# EAGLE design nanoPhant (EAGLE 9.2.2)
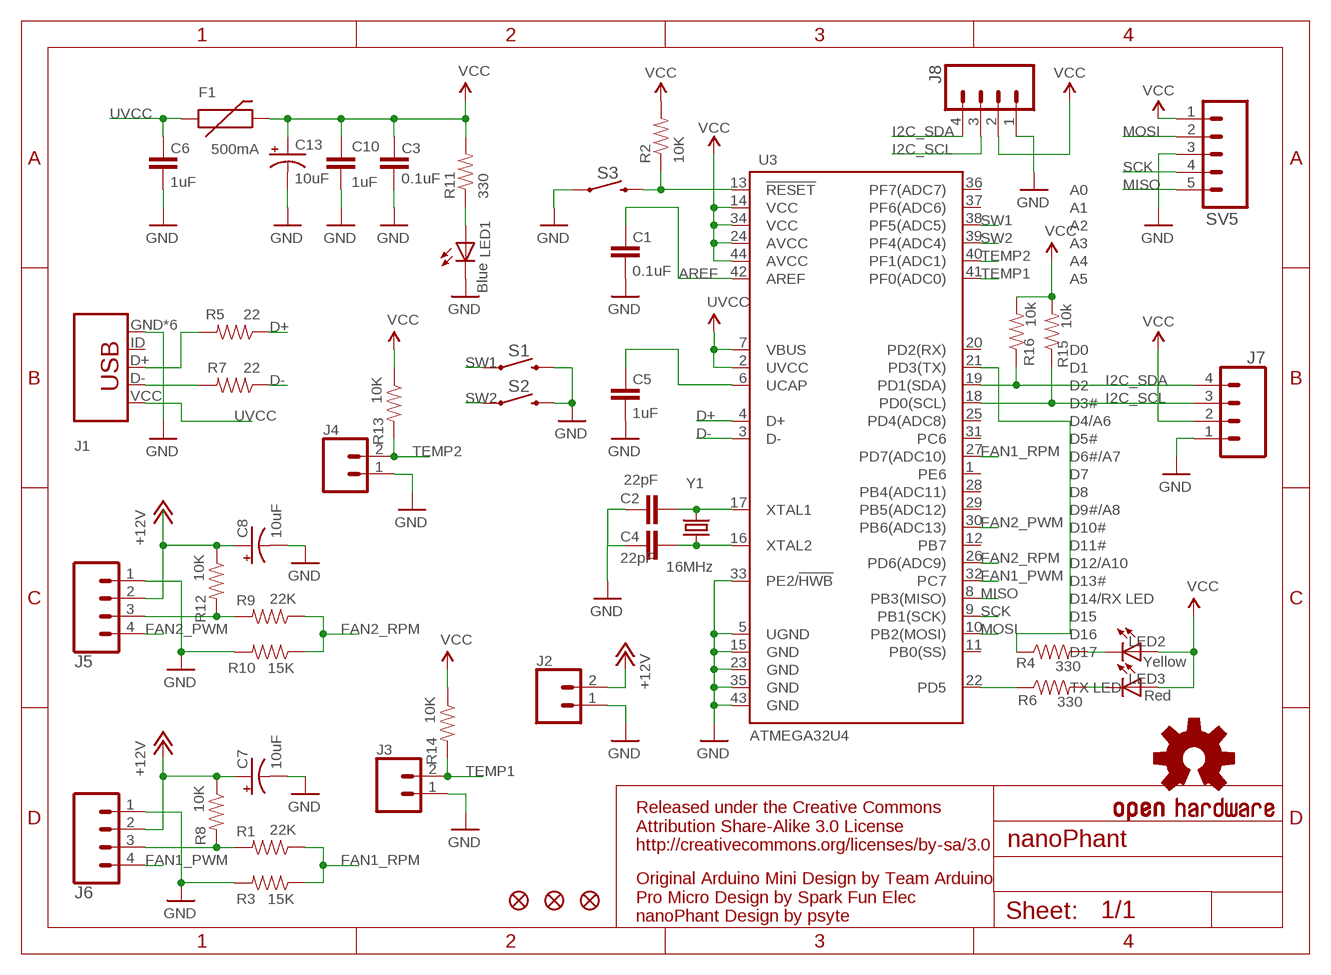
[diagram p0: schematic, sheet 1]

## Parts
C1  0.1uF  C-EUC0603  [C0603]
C2  22pF  C-EUC0603  [C0603]
C3  0.1uF  C-EUC0603  [C0603]
C4  22pF  C-EUC0603  [C0603]
C5  1uF  C-EUC0603  [C0603]
C6  1uF  C-EUC0603  [C0603]
C7  10uF  CAP_POL1206  [EIA3216]
C8  10uF  CAP_POL1206  [EIA3216]
C10  1uF  C-EUC0603  [C0603]
C13  10uF  CAP_POL1206  [EIA3216]
F1  500mA  PTCSMD  [PTC-1206]
FD1  FIDUCIAL1X2  [FIDUCIAL-1X2]
FD2  FIDUCIAL1X2  [FIDUCIAL-1X2]
FD3  FIDUCIAL1X2  [FIDUCIAL-1X2]
J1  AMP FCI 10103594-0001LF  MICRO-USB-B  [MICRO_USB_4_LEGS]
J2  CONN_02  [1X02]
J3  CONN_02  [1X02]
J4  CONN_02  [1X02]
J5  CONN_04  [1X04]
J6  CONN_04  [1X04]
J7  CONN_04  [1X04]
J8  CONN_04  [1X04]
LED1  Blue  LED0603  [LED-0603]
LED2  Yellow  LED0603  [LED-0603]
LED3  Red  LED0603  [LED-0603]
R1  22K  RESISTOR0603-RES  [0603-RES]
R2  10K  RESISTOR0603-RES  [0603-RES]
R3  15K  RESISTOR0603-RES  [0603-RES]
R4  330  RESISTOR0603-RES  [0603-RES]
R5  22  RESISTOR0603-RES  [0603-RES]
R6  330  RESISTOR0603-RES  [0603-RES]
R7  22  RESISTOR0603-RES  [0603-RES]
R8  10K  RESISTOR0603-RES  [0603-RES]
R9  22K  RESISTOR0603-RES  [0603-RES]
R10  15K  RESISTOR0603-RES  [0603-RES]
R11  330  RESISTOR0603-RES  [0603-RES]
R12  10K  RESISTOR0603-RES  [0603-RES]
R13  10K  RESISTOR0603-RES  [0603-RES]
R14  10K  RESISTOR0603-RES  [0603-RES]
R15  10k  RESISTOR0603-RES  [0603-RES]
R16  10k  RESISTOR0603-RES  [0603-RES]
S1  MOMENTARY-SWITCH-SPST-SMD-6.0X3.5MM  [TACTILE_SWITCH_SMD_6.0X3.5MM]
S2  MOMENTARY-SWITCH-SPST-SMD-6.0X3.5MM  [TACTILE_SWITCH_SMD_6.0X3.5MM]
S3  MOMENTARY-SWITCH-SPST-SMD-6.0X3.5MM  [TACTILE_SWITCH_SMD_6.0X3.5MM]
SV5  CONN_05  [1X05]
U3  ATMEGA32U4  ATMEGA32U4OUTFAKES  [QFN-44-NOPAD_1:1-OUTFAKES]
U$3  OSHW-LOGOS  [OSHW-LOGO-S]
Y1  16MHz  CRYSTAL5X3  [CRYSTAL-SMD-5X3]

## Nets
+12V: C7.A(+) C8.A(+) J2.2 J5.2 J6.2 R8.1 R12.1
AREF: C1.2 U3.42(AREF)
D+: R5.1 U3.4(D+)
D-: R7.1 U3.3(D-)
FAN1_PWM: J6.4 U3.32(PC7)
FAN1_RPM: R1.1 R3.1 U3.27(PD7(ADC10))
FAN2_PWM: J5.4 U3.30(PB6(ADC13))
FAN2_RPM: R9.1 R10.1 U3.26(PD6(ADC9))
GND [vcc]: C1.1 C2.2 C3.1 C4.2 C5.1 C6.1 C7.C(-) C8.C(-) C10.2 C13.C(-) J1.GND J1.P$1(GND) J1.P$2(GND) J1.P$3(GND) J1.P$4(GND) J1.P$5(GND) J2.1 J3.1 J4.1 J5.1 J6.1 J7.1 J8.1 LED1.C R3.2 R10.2 S1.2 S2.2 S3.1 SV5.3 U3.5(UGND) U3.15(GND) U3.23(GND) U3.33(PE2/!HWB) U3.35(GND) U3.43(GND)
I2C_SCL: J7.3 J8.3 R15.1 U3.18(PD0(SCL))
I2C_SDA: J7.4 J8.4 R16.1 U3.19(PD1(SDA))
MISO: SV5.5 U3.8(PB3(MISO))
MOSI: SV5.2 U3.10(PB2(MOSI))
N$1: C4.1 U3.16(XTAL2) Y1.1
N$2: C2.1 U3.17(XTAL1) Y1.3
N$3: R4.1 U3.21(PD3(TX))
N$4: C5.2 U3.6(UCAP)
N$5: LED2.C R4.2
N$6: J1.D- R7.2
N$7: LED3.C R6.2
N$8: J1.D+ R5.2
N$9: J6.3 R1.2 R8.2
N$10: J5.3 R9.2 R12.2
N$38: LED1.A R11.1
RESET: R2.1 S3.2 U3.13(!RESET)
SCK: SV5.4 U3.9(PB1(SCK))
SW1: S1.1 U3.38(PF5(ADC5))
SW2: S2.1 U3.39(PF4(ADC4))
TEMP1: J3.2 R14.2 U3.41(PF0(ADC0))
TEMP2: J4.2 R13.2 U3.40(PF1(ADC1))
TXLED: R6.1 U3.22(PD5)
UVCC: C6.2 F1.1 J1.VCC(VBUS) U3.2(UVCC) U3.7(VBUS)
VCC: C3.2 C10.1 C13.A(+) F1.2 J7.2 J8.2 LED2.A LED3.A R2.2 R11.2 R13.1 R14.1 R15.2 R16.2 SV5.1 U3.14(VCC) U3.24(AVCC) U3.34(VCC) U3.44(AVCC)
Unconnected: J1.ID U3.1(PE6) U3.11(PB0(SS)) U3.12(PB7) U3.20(PD2(RX)) U3.25(PD4(ADC8)) U3.28(PB4(ADC11)) U3.29(PB5(ADC12)) U3.31(PC6) U3.36(PF7(ADC7)) U3.37(PF6(ADC6))

## Notes on the sheet
- Released under the Creative Commons
  Attribution Share-Alike 3.0 License
  http://creativecommons.org/licenses/by-sa/3.0
- Original Arduino Mini Design by Team Arduino
  Pro Micro Design by Spark Fun Elec
  nanoPhant Design by psyte

## Library data of the parts
C1-C6 C10 = rcl:C-EU: CAPACITOR, European symbol; SPICEPREFIX: C
C7 C8 C13 = SparkFun:CAP_POL: Capacitor Polarized These are standard SMD and PTH capacitors. Normally 10uF, 47uF, and 100uF in electrolytic and tantalum varieties. Always verify the external diameter of the through hole cap, it varies with capacity, voltage, and manufacturer. The EIA devices should be standard.
F1 = SparkFun:PTC: Resettable Fuse PTC Resettable Fuse. Spark Fun Electronics SKU : COM-08357
FD1-FD3 = SparkFun-Aesthetics:FIDUCIAL: Fiducial Alignment Points Point-of-reference for pick-and-place machines and other optical instruments.
J1 = pmc_lib:MICRO-USB-B
J2-J4 = SparkFun-Connectors:CONN_02: Multi connection point. Often used as Generic Header-pin footprint for 0.1 inch spaced/style header connections On any of the 0.1 inch spaced packages, you can populate with these: Break Away Headers - Straight <https://www.sparkfun.com/products/116> (PRT-00116) Break Away Male Headers - Right Angle <https://www.sparkfun.com/products/553> (PRT-00553) Female Headers <https://www.sparkfun.com/products/115> (PRT-00115) Break Away Headers - Machine Pin <https://www.sparkfun.com/products/117> (PRT-00117) Break Away Female Headers - Swiss Machine Pin <https://www.sparkfun.com/products/743> (PRT-00743) For SCREWTERMINALS and SPRING TERMINALS visit here: Screw Terimnals on SparkFun.com <https://www.sparkfun.com/search/results?term=Screw+Terminals> (5mm/3.5mm/2.54mm spacing) This device is also useful as a general connection point to wire up your design to another part of your project. Our various solder wires solder well into these plated through hole pads. Hook-Up Wire - Assortment (Stranded, 22 AWG) <https://www.sparkfun.com/products/11375> (PRT-11375) Hook-Up Wire - Assortment (Solid Core, 22 AWG) <https://www.sparkfun.com/products/11367> (PRT-11367) View the entire wire category on our website here <https://www.sparkfun.com/categories/141> Special notes: Molex polarized connector foot print use with: PRT-08233 with associated crimp pins and housings. 2.54_SCREWTERM for use with PRT-10571. 3.5mm Screw Terminal footprints for PRT-08084 5mm Screw Terminal footprints for use with PRT-08432
J5-J8 = SparkFun-Connectors:CONN_04: Multi connection point. Often used as Generic Header-pin footprint for 0.1 inch spaced/style header connections On any of the 0.1 inch spaced packages, you can populate with these: Break Away Headers - Straight <https://www.sparkfun.com/products/116> (PRT-00116) Break Away Male Headers - Right Angle <https://www.sparkfun.com/products/553> (PRT-00553) Female Headers <https://www.sparkfun.com/products/115> (PRT-00115) Break Away Headers - Machine Pin <https://www.sparkfun.com/products/117> (PRT-00117) Break Away Female Headers - Swiss Machine Pin <https://www.sparkfun.com/products/743> (PRT-00743) For SCREWTERMINALS and SPRING TERMINALS visit here: Screw Terimnals on SparkFun.com <https://www.sparkfun.com/search/results?term=Screw+Terminals> (5mm/3.5mm/2.54mm spacing) This device is also useful as a general connection point to wire up your design to another part of your project. Our various solder wires solder well into these plated through hole pads. Hook-Up Wire - Assortment (Stranded, 22 AWG) <https://www.sparkfun.com/products/11375> (PRT-11375) Hook-Up Wire - Assortment (Solid Core, 22 AWG) <https://www.sparkfun.com/products/11367> (PRT-11367) View the entire wire category on our website here <https://www.sparkfun.com/categories/141> Special notes: Molex polarized connector foot print use with SKU : PRT-08231 with associated crimp pins and housings. 1MM SMD Version SKU: PRT-10208; PROD_ID: CONN-09696
LED1-LED3 = SparkFun:LED: LEDs Standard schematic elements and footprints for 5mm, 3mm, 1206, and 0603 sized LEDs. 5mm - Spark Fun Electronics SKU : COM-00529 (and others)
R1-R16 = SparkFun:RESISTOR: Resistor Basic schematic elements and footprints for 0603, 1206, and PTH resistors.
S1-S3 = SparkFun-Switches:MOMENTARY-SWITCH-SPST: Momentary Switch (Pushbutton) - SPST Normally-open (NO) SPST momentary switches (buttons, pushbuttons). Variants PTH-12MM - 12mm square, through-hole Momentary Pushbutton Switch - 12mm Square <https://www.sparkfun.com/products/9190> (COM-09190) PTH-6.0MM, PTH-6.0MM-KIT - 6.0mm square, through-hole Mini Pushbutton Switch <https://www.sparkfun.com/products/97> (COM-00097) KIT package intended for soldering kit's - only one side of pads' copper is exposed. PTH-RIGHT-ANGLE-KIT - Right-angle, through-hole Right Angle Tactile Button <https://www.sparkfun.com/products/10791> - Used on SparkFun BigTime Watch Kit <https://www.sparkfun.com/products/11734> SMD-12MM - 12mm square, surface-mount Tactile Button - SMD (12mm) <https://www.sparkfun.com/products/12993> (COM-12993) Used on SparkFun PicoBoard <https://www.sparkfun.com/products/11888> SMD-4.5MM - 4.5mm Square Trackball Switch Used on SparkFun Blackberry Trackballer Breakout <https://www.sparkfun.com/products/13169> SMD-4.6MMX2.8MM - 4.60mm x 2.80mm, surface mount Used on SparkFun SAMD21 Mini Breakout <https://www.sparkfun.com/products/13664> SMD-5.2MM, SMD-5.2-REDUNDANT - 5.2mm square, surface-mount Mini Pushbutton Switch - SMD <https://www.sparkfun.com/products/8720> (COM-08720) Used on Arduino Pro Mini <https://www.sparkfun.com/products/11114> REDUNDANT package connects both switch circuits together SMD-6.0X3.5MM - 6.0 x 3.5mm, surface mount Momentary Reset Switch SMD <https://www.sparkfun.com/products/8229> (COM-08229) SMD-6.2MM-TALL - 6.2mm square, surface mount Tactile Button - SMD (6mm) <https://www.sparkfun.com/products/12992> Used on SparkFun Digital Sandbox <https://www.sparkfun.com/products/12651> SMD-RIGHT-ANGLE - Right-angle, surface mount Used on SparkFun Block for Intel® Edison - Arduino <https://www.sparkfun.com/products/13036>; PROD_ID: SWCH-00815; SF_SKU: COM-08229
SV5 = SparkFun-Connectors:CONN_05: Multi connection point. Often used as Generic Header-pin footprint for 0.1 inch spaced/style header connections On any of the 0.1 inch spaced packages, you can populate with these: Break Away Headers - Straight <https://www.sparkfun.com/products/116> (PRT-00116) Break Away Male Headers - Right Angle <https://www.sparkfun.com/products/553> (PRT-00553) Female Headers <https://www.sparkfun.com/products/115> (PRT-00115) Break Away Headers - Machine Pin <https://www.sparkfun.com/products/117> (PRT-00117) Break Away Female Headers - Swiss Machine Pin <https://www.sparkfun.com/products/743> (PRT-00743) For SCREWTERMINALS and SPRING TERMINALS visit here: Screw Terimnals on SparkFun.com <https://www.sparkfun.com/search/results?term=Screw+Terminals> (5mm/3.5mm/2.54mm spacing) This device is also useful as a general connection point to wire up your design to another part of your project. Our various solder wires solder well into these plated through hole pads. Hook-Up Wire - Assortment (Stranded, 22 AWG) <https://www.sparkfun.com/products/11375> (PRT-11375) Hook-Up Wire - Assortment (Solid Core, 22 AWG) <https://www.sparkfun.com/products/11367> (PRT-11367) View the entire wire category on our website here <https://www.sparkfun.com/categories/141> Special notes: Molex polarized connector foot print use with SKU : PRT-08231 with associated crimp pins and housings. 1MM SMD Version SKU: PRT-10208
U3 = Testing:ATMEGA32U4: Atmel 44-pin 8-bit Microcontroller with 32KBytes of ISP Flash and USB Controller
U$3 = SparkFun:OSHW-LOGO: Open Source Hardware Logo This logo indicates the piece of hardware it is found on incorporates a OSHW license and/or adheres to the definition of open source hardware found here: http://freedomdefined.org/OSHW
Y1 = SparkFun:CRYSTAL: Crystals Various standard crystals. Proven footprints. Spark Fun Electronics SKU : COM-00534

## Net classes
0 default: width 0.203 mm

## Board
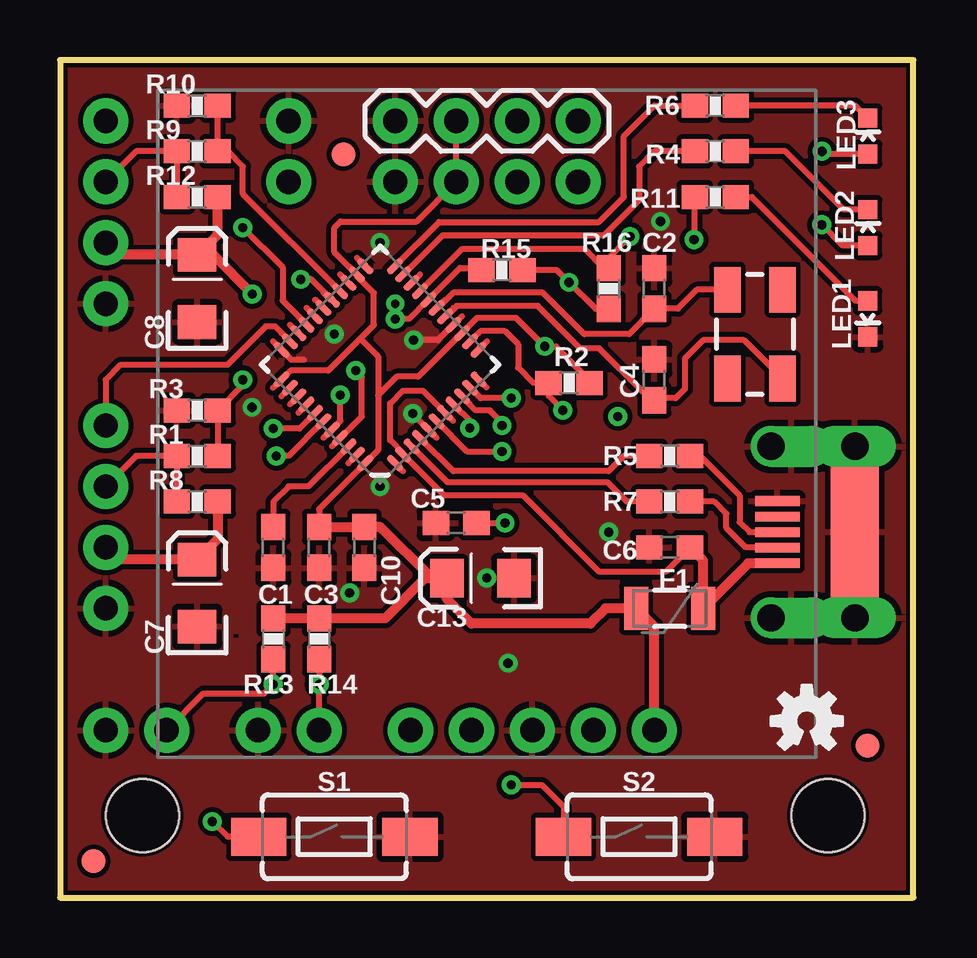
[diagram p1: board, top side]
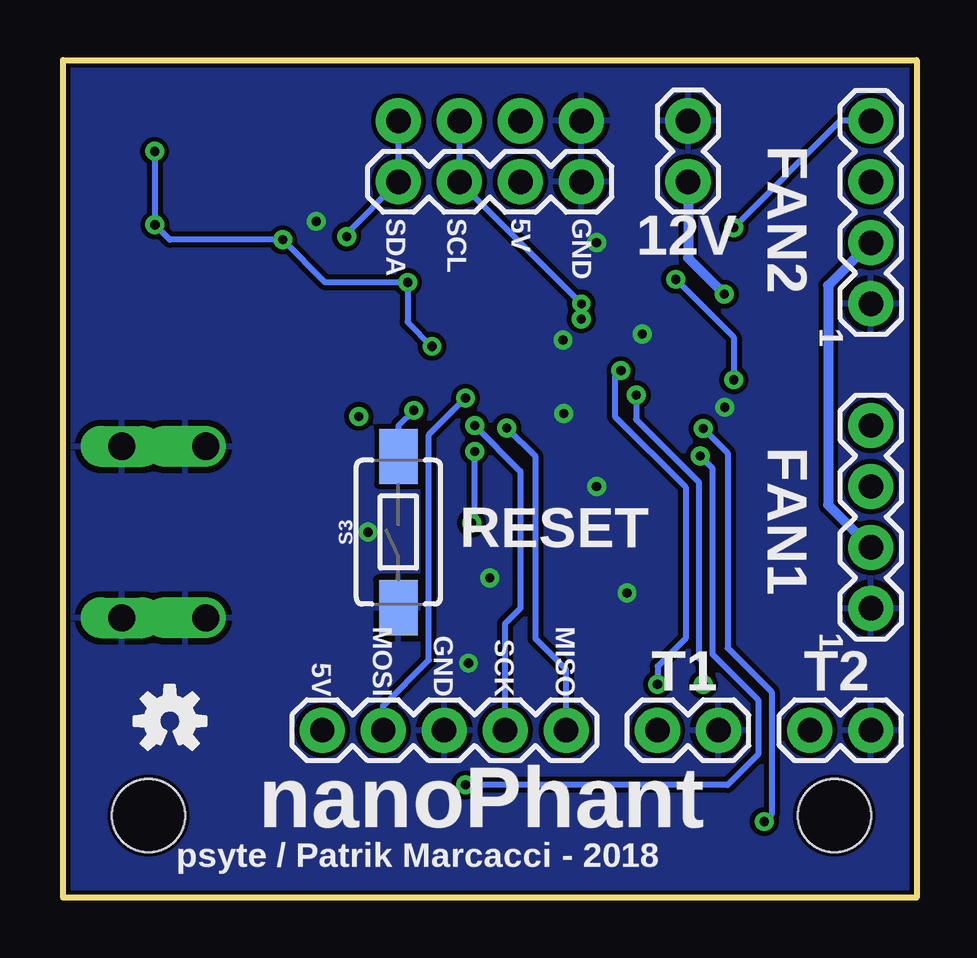
[diagram p2: board, bottom side, seen from below]

Size 35.56 x 34.92 mm. Coordinates in mm from the lower left corner, seen from the top.
Outline: 0,34.92 0,0 35.56,0 35.56,34.92 0,34.92
Copper layers (1*16): Top 0.035mm / dielectric 1.5mm / Bottom 0.035mm
Design rules "SparkFun *": minimum track width 8mil, minimum drill 15mil, track to track 8mil, track to pad 8mil, pad to pad 8mil, via to via 8mil, smd to smd 0mil, copper to edge 7mil, drill to drill 7mil, minimum pad ring 8mil, minimum via ring 8mil, stop-mask expansion 1mil, vias tented up to drill 16mil, thermal gap 10mil
Holes 3.05 mm at 3.43,3.43 32,3.43
tRestrict: area 7.2,10.9 to 7.4,11

### Footprints (pad centres in the part's own frame; a part is rotated, then mirrored left to right if it is on the bottom)
C0603 = smd 1.1 x 1: 1 -0.85,0; 2 0.85,0
EIA3216 = smd 1.4 x 1.6: A 1.4,0; C -1.4,0
PTC-1206 = smd 1 x 1.8: 1 -1.4,0; 2 1.4,0
FIDUCIAL-1X2 = smd 1 x 1: 1 0,0
MICRO_USB_4_LEGS = smd 1.85 x 0.4: D+ 3.125,0; D- 3.125,0.65; GND 3.125,-1.3; ID 3.125,-0.65; VCC 3.125,1.3 | drill 1.143 pad 1.524 long: P$1 -0.1,3.575; P$2 -0.1,-3.575 | drill 1.143 pad 1.524 offset: P$3 3.4,3.575; P$5 3.4,-3.575 | smd 2 x 6: P$4 -0.1,0
1X02 = drill 1.016 pad 1.88: 1 0,0; 2 2.54,0
1X04 = drill 1.016 pad 1.88: 1 0,0; 2 2.54,0; 3 5.08,0; 4 7.62,0
LED-0603 = smd 0.8 x 0.8: A 0,-0.75; C 0,0.75
0603-RES = smd 1.1 x 1: 1 -0.85,0; 2 0.85,0
TACTILE_SWITCH_SMD_6.0X3.5MM = smd 2.3 x 1.6: 1 -3.15,0; 2 3.15,0
1X05 = drill 1.016 pad 1.88: 1 0,0; 2 2.54,0; 3 5.08,0; 4 7.62,0; 5 10.16,0
QFN-44-NOPAD_1:1-OUTFAKES = smd 0.8 x 0.3: 1 -3.337,2.465; 2 -3.337,1.972; 3 -3.337,1.479; 4 -3.337,0.986; 5 -3.337,0.493; 6 -3.337,0; 7 -3.337,-0.493; 8 -3.337,-0.986; 9 -3.337,-1.479; 10 -3.337,-1.972; 11 -3.337,-2.465; 23 3.337,-2.465; 24 3.337,-1.972; 25 3.337,-1.479; 26 3.337,-0.986; 27 3.337,-0.493; 28 3.337,0; 29 3.337,0.493; 30 3.337,0.986; 31 3.337,1.479; 32 3.337,1.972; 33 3.337,2.465 | smd 0.3 x 0.8: 12 -2.465,-3.337; 13 -1.972,-3.337; 14 -1.479,-3.337; 15 -0.986,-3.337; 16 -0.493,-3.337; 17 0,-3.337; 18 0.493,-3.337; 19 0.986,-3.337; 20 1.479,-3.337; 21 1.972,-3.337; 22 2.465,-3.337; 34 2.465,3.337; 35 1.972,3.337; 36 1.479,3.337; 37 0.986,3.337; 38 0.493,3.337; 39 0,3.337; 40 -0.493,3.337; 41 -0.986,3.337; 42 -1.479,3.337; 43 -1.972,3.337; 44 -2.465,3.337
CRYSTAL-SMD-5X3 = smd 1.9 x 1.1: 1 -1.85,-1.15; 2 1.85,-1.15; 3 1.85,1.15; 4 -1.85,1.15

### Placement (x,y rotation side)
C1  8.89,14.61 90 top
C2  24.77,25.4 90 top
C3  10.79,14.61 90 top
C4  24.77,21.59 90 top
C5  16.51,15.62 0 top
C6  25.4,14.61 0 top
C7  5.71,12.7 90 top
C8  5.71,25.4 90 top
C10  12.69,14.61 270 top
C13  17.52,13.32 180 top
F1  25.4,12.06 180 top
FD1  33.66,6.35 0 top
FD2  11.81,30.99 0 top
FD3  1.4,1.52 0 top
J1  33.02,15.24 180 top
J2  9.53,32.38 270 bottom
J3  8.26,6.99 180 bottom
J4  1.91,6.99 180 bottom
J5  1.91,24.77 90 bottom
J6  1.91,12.06 90 bottom
J7  13.97,29.84 180 bottom
J8  13.97,32.38 0 top
LED1  33.66,24.13 180 top
LED2  33.66,27.94 0 top
LED3  33.66,31.75 0 top
R1  5.71,18.41 180 top
R2  21.21,21.46 0 top
R3  5.71,20.32 180 top
R4  27.3,31.11 0 top
R5  25.4,18.41 0 top
R6  27.3,33.02 0 top
R7  25.4,16.51 0 top
R8  5.71,16.51 180 top
R9  5.71,31.11 180 top
R10  5.71,33.02 180 top
R11  27.3,29.21 180 top
R12  5.71,29.21 180 top
R13  8.89,10.79 270 top
R14  10.79,10.79 270 top
R15  18.41,26.16 0 top
R16  22.86,25.4 270 top
S1  11.43,2.54 0 top
S2  24.13,2.54 0 top
S3  21.59,15.24 90 bottom
SV5  24.77,6.99 0 bottom
U3  13.34,22.23 135 top
U$1  OSHW-LOGOS  [OSHW-LOGO-S]  31.11,7.37 0 top
U$3  31.11,7.37 0 bottom
Y1  28.96,23.5 90 top

### Tracks (layer width: path | path; a pad name or v marks a point on that pad's centre or on a via)
+12V  (via drill 0.38)
  Top 0.406: J6.2 2.41,14.1 C7.A 6.57,14.95 R8.1 | C8.A 2.41,26.8 J5.2 | C8.A 6.57,27.65 R12.1 | v8.02,25.16 6.38,26.8 C8.A
  Bottom 0.406: J2.2 9.53,26.67 v8.02,25.16 | J5.2 3.68,25.53 3.68,16.38 J6.2
AREF
  Top 0.254: U3.42 10.35,17.14 9.53,17.14 8.89,16.51 C1.2
D+
  Top 0.254: U3.4 16.39,17.78 22.86,17.78 23.5,18.41 R5.1
D-
  Top 0.254: U3.3 16.15,17.32 22.82,17.32 23.62,16.51 R7.1
FAN1_PWM
  Top 0.254: J6.4 1.91,21.59 2.54,22.23 6.99,22.23 8.57,23.81 8.96,23.81 U3.32
FAN1_RPM  (via drill 0.38)
  Top 0.254: 10.98,25.23 11.27,24.93 U3.27 10.48,25.78 v10.03,25.78 | v7.62,21.59 7.62,21.38 R3.1 R1.1
  Bottom 0.254: v10.03,25.78 7.62,23.37 v7.62,21.59
FAN2_PWM  (via drill 0.38)
  Top 0.254: v7.62,27.94 9.27,26.29 9.27,24.89 U3.30
  Bottom 0.254: v7.62,27.94 3.17,32.38 J5.4
FAN2_RPM
  Top 0.254: U3.26 7.62,29.33 7.62,30.48 6.99,31.11 R9.1 R10.1
GND  (via drill 0.38)
  Top 0.254: U3.5 14.7,20.16 v14.7,20.19 | U3.15 15.74,23.24 v14.73,23.24 | U3.33 9.65,22.43 10.16,22.43
  other vias: 11.43,23.5 13.34,17.14 17.78,13.34 22.86,15.24 8,20.45 12.06,12.7 25.02,28.19 13.34,27.3 18.67,9.78
  pour Top: 0,34.92 35.56,34.92 35.56,0 0,0
  pour Bottom: 0,34.92 35.56,34.92 35.56,0 0,0
I2C_SCL  (via drill 0.35, 0.38)
  Top 0.254: R15.1 17.48,26.25 16.66,26.25 U3.18 14.54,24.13 v13.97,24.13
  Bottom 0.254: J8.3 J7.3 v13.97,24.77 v13.97,24.13
I2C_SDA  (via drill 0.38)
  Top 0.254: U3.19 16.77,27.05 21.84,27.05 22.64,26.25 R16.1 22.86,26.67 v23.75,27.56
  Bottom 0.254: J8.4 J7.4 23.75,27.69 v23.75,27.56
MISO  (via drill 0.38)
  Top 0.254: v17.08,19.59 17.07,19.6 17.07,19.89 U3.8
  Bottom 0.254: v17.08,19.59 15.88,18.38 15.88,10.79 14.61,9.53 SV5.5
MOSI  (via drill 0.38)
  Top 0.254: U3.10 17.53,20.82 v18.79,20.82 v18.8,20.83
  Bottom 0.254: SV5.2 22.23,8 20.32,9.91 20.32,19.3 v18.8,20.83
N$1
  Top 0.254: U3.16 16.1,24.24 16.53,24.67 19.91,24.67 21.67,22.9 22.48,22.9 24.26,21.12 24.38,21.12 C4.1 24.85,20.83 25.65,20.83 26.04,21.21 26.04,22.48 26.8,23.24 28.51,23.24 Y1.1
N$2
  Top 0.254: U3.17 15.75,24.58 16.39,25.23 20.11,25.23 21.84,23.5 23.71,23.5 C2.1 25.74,24.55 26.54,25.34 Y1.3
N$3
  Top 0.254: U3.21 15.93,27.61 22.66,27.61 24.13,29.08 24.13,30.48 24.77,31.11 R4.1
N$4  (via drill 0.38)
  Top 0.254: U3.6 16.95,18.61 v18.41,18.61 | C5.2 v18.54,15.62
  Bottom 0.254: v18.54,15.62 18.41,15.75 v18.41,18.61
N$5
  Top 0.254: LED2.C 32.65,28.69 30.23,31.11 R4.2
N$6
  Top 0.254: J1.D- 29.88,14.61 28.57,14.61 27.76,15.42 27.76,16 27.25,16.51 R7.2
N$7
  Top 0.254: LED3.C 33.13,33.02 R6.2
N$8
  Top 0.254: R5.2 26.67,18.41 28.32,16.76 28.32,15.65 28.73,15.24 J1.D+
N$9
  Top 0.254: R8.2 R1.2 3.17,18.41 J6.3
N$10
  Top 0.254: R12.2 R9.2 3.17,31.11 J5.3
N$11  (via drill 0.38)
  other vias: 23.24,20.07
N$38
  Top 0.254: LED1.A 33.16,24.88 28.83,29.21 R11.1
RESET  (via drill 0.38)
  Top 0.254: U3.13 17.52,23.62 18.54,23.62 19.09,23.07 19.09,22.1 19.72,21.46 R2.1 20.36,20.92 v20.95,20.32
  Bottom 0.254: v20.95,20.32 21.59,19.68 S3.2
SCK  (via drill 0.38)
  Top 0.254: U3.9 17.33,20.32 17.91,20.32 18.41,19.81 v18.41,19.68
  Bottom 0.254: SV5.4 17.14,11.43 16.51,12.06 16.51,17.78 v18.41,19.68
SW1  (via drill 0.38)
  Top 0.254: U3.38 9.97,19.56 v8.89,19.56 | S1.1 6.99,2.54 v6.35,3.17
  Bottom 0.254: v8.89,19.56 7.87,18.54 7.87,10.41 6.04,8.59 6.04,3.48 v6.35,3.17
SW2  (via drill 0.38)
  Top 0.254: U3.39 9.53,18.41 v9.02,18.41 | v18.8,4.7 20.07,4.7 20.98,3.79 S2.1
  Bottom 0.254: v9.02,18.41 8.51,17.91 8.51,10.16 6.6,8.26 6.6,5.97 7.87,4.7 v18.8,4.7
TEMP1  (via drill 0.38)
  Top 0.254: U3.41 12.57,20.07 12.57,21.72 v12.32,21.97 | R14.2 v10.79,8.89 J3.2
  Bottom 0.254: v12.32,21.97 12.57,21.72 12.57,20.07 9.63,17.12 9.63,10.82 10.79,9.65 v10.79,8.89
TEMP2  (via drill 0.38)
  Top 0.254: J4.2 5.97,8.51 8.51,8.51 v8.89,8.89 R13.2 | U3.40 11.68,19.88 v11.68,20.95
  Bottom 0.254: v11.68,20.95 11.68,19.94 9.07,17.32 9.07,9.98 8.89,9.8 v8.89,8.89
TXLED
  Top 0.254: U3.22 15.79,28.17 22.45,28.17 23.5,29.21 23.5,31.75 24.77,33.02 R6.1
UVCC
  Top 0.254: U3.7 15.12,21.14 14.28,21.14 13.75,20.61 13.75,19.07 14.3,18.52 U3.2 16.01,16.76 19.3,16.76 22.48,13.59 25.23,13.59 C6.2
  Top 0.406: J1.VCC 28.68,13.94 F1.1 26.8,14.05 C6.2
VCC  (via drill 0.38)
  Top 0.254: C3.2 10.79,16.2 U3.44 13.26,18.66 13.26,20.95 | 13.26,20.95 13.26,22.55 12.51,23.3 | U3.34 9.6,21.97 11.18,21.97 12.51,23.3 | R15.2 20.7,26.16 v21.21,25.65 22.31,24.55 R16.2 | R2.2 22.06,21.59 20.66,22.99 v20.19,22.99 19,24.18 17.38,24.18 U3.14 14.92,21.72 14.02,21.72 13.26,20.95 | 12.51,23.3 13.08,23.88 13.08,25.21 12.37,25.93 U3.24 11.43,26.92 11.43,27.94 11.68,28.19 14.86,28.19 J7.2 J8.2 | v26.42,27.43 26.45,27.47 R11.2 | LED3.A 31.86,31 v31.75,31.11 | LED2.A 32.6,27.19 v31.74,28.05
  Top 0.406: C3.2 C10.1 13.35,15.46 15.48,13.32 15.23,13.32 | R13.1 R14.1 13.55,11.64 15.23,13.32 | SV5.1 24.77,11.3 F1.2 22.73,12.06 22.09,11.43 17.14,11.43 16.12,12.46 C13.A | C13.A | C13.A 15.23,13.32 | 15.23,13.32
  Bottom 0.254: v20.19,22.99 21.21,24 v21.21,25.65 24.64,25.65 v26.42,27.43 31.11,27.43 v31.74,28.05 31.75,28.07 v31.75,31.11

### Text on the board
bPlace: FAN2 | GND | 5V | SCL | SDA | 12V | 1 | FAN1 | RESET | 1 | T2 | T1 | MISO | SCK | GND | MOSI | 5V | nanoPhant | psyte / Patrik Marcacci - 2018